# EAGLE schematic Projet_4A (EAGLE 9.6.2)
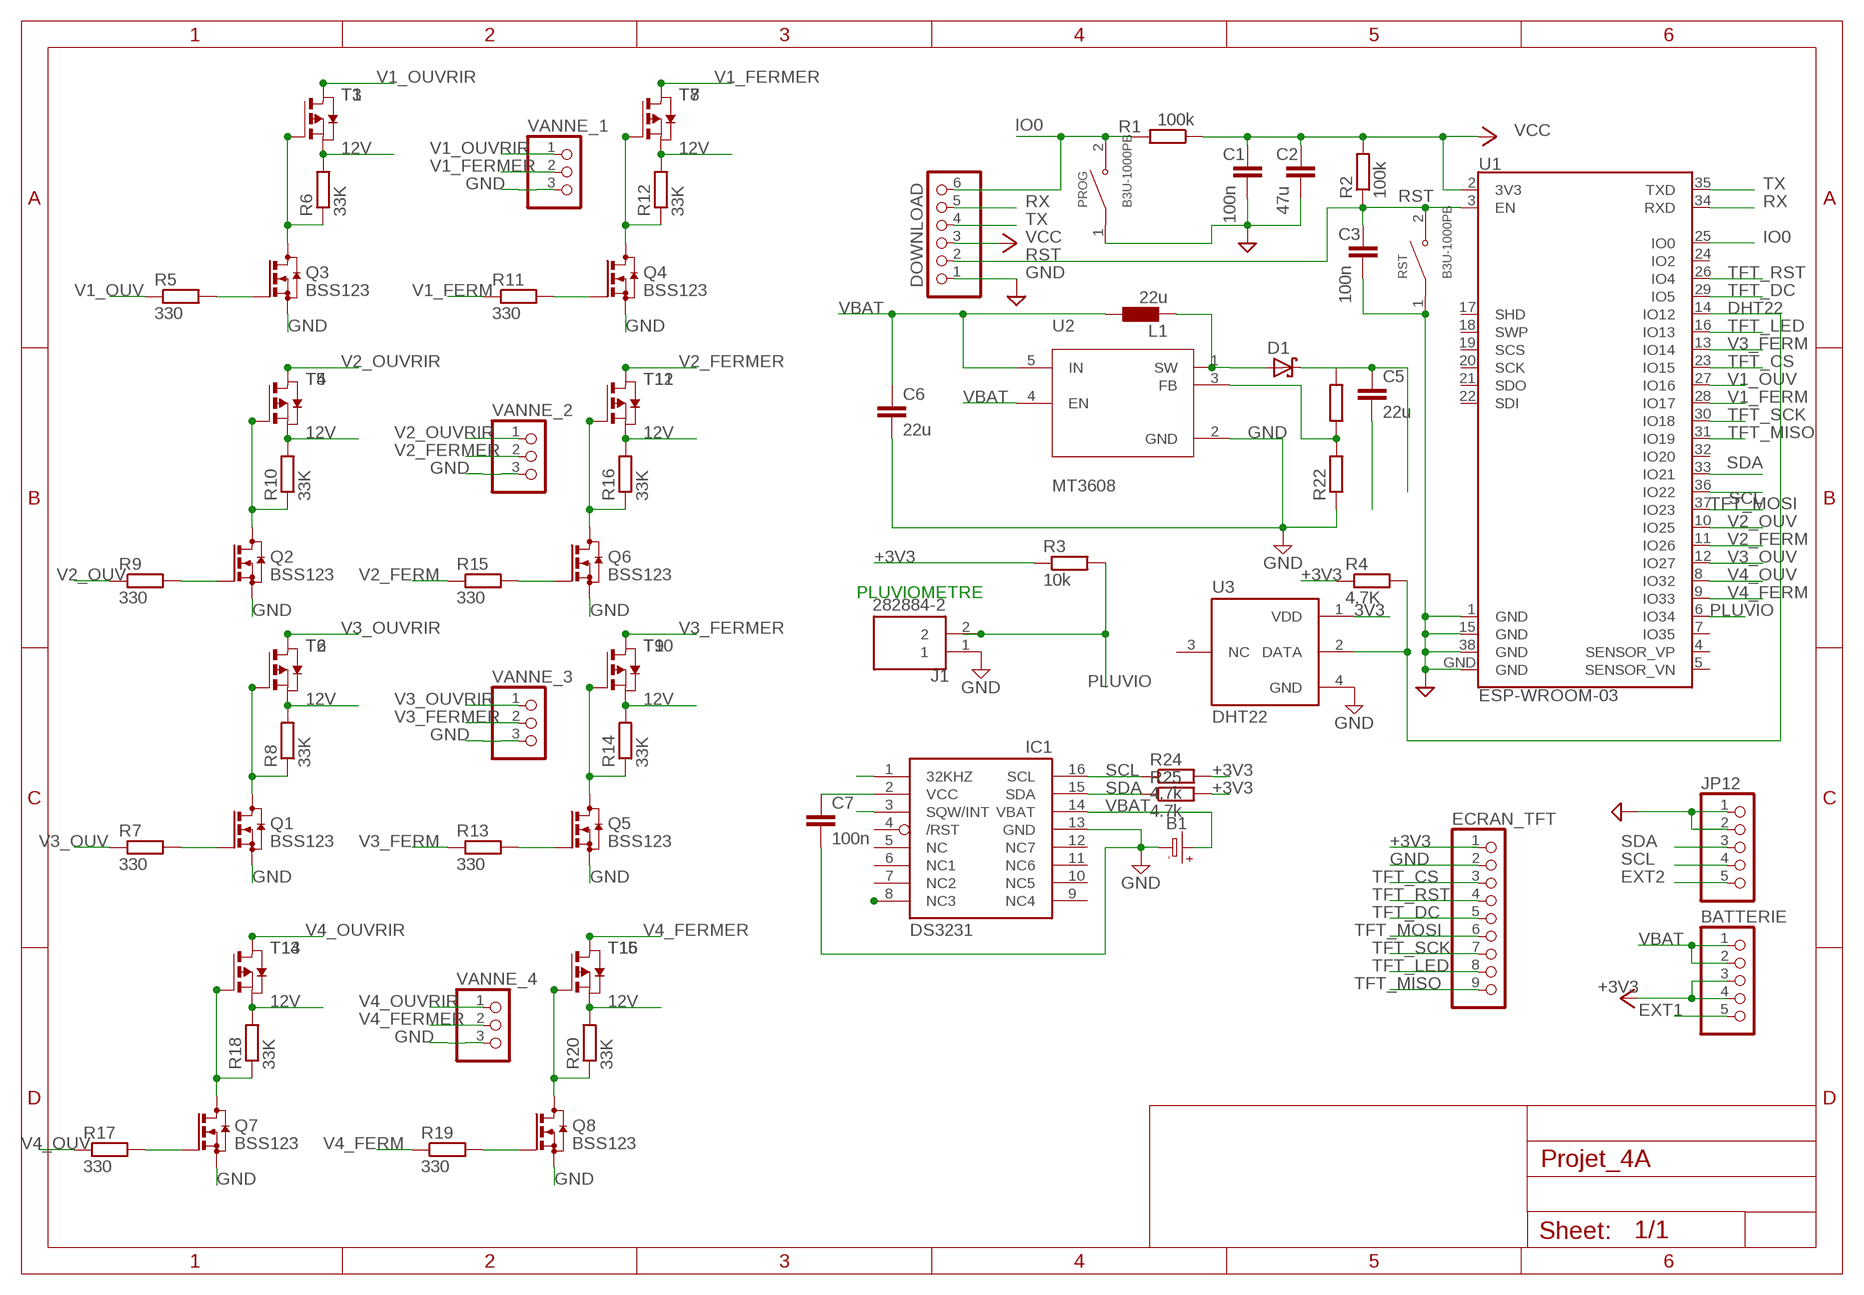
[diagram p0: schematic, sheet 1]

## Parts
B1  BATTERYCR2032_BAT-HLD-001  [CR2032_SMT_BAT-HLD-001]
BATTERIE  PINHD-1X5S  [1X05S]
C1  100n  C  [C0805]
C2  47u  C  [C0805]
C3  100n  C  [C0805]
C5  22u  C  [C0805]
C6  22u  C  [C0805]
C7  100n  C  [C0805]
D1  SCHOTTKY-DIODEAG  [AG]
DOWNLOAD  PINHD-1X6S  [1X06S]
ECRAN_TFT  PINHD-1X9  [1X09]
IC1  DS3231/SO  [SO16W]
J1  282884-2  [TE_282884-2]
JP12  PINHD-1X5S  [1X05S]
L1  22u  L0204/7  [0204/7]
PROG  B3U-1000PB  [SW_B3U-1000PB]
Q1  BSS123  [SOT23]
Q2  BSS123  [SOT23]
Q3  BSS123  [SOT23]
Q4  BSS123  [SOT23]
Q5  BSS123  [SOT23]
Q6  BSS123  [SOT23]
Q7  BSS123  [SOT23]
Q8  BSS123  [SOT23]
R1  100k  RR1206  [R1206]
R2  100k  RR1206  [R1206]
R3  10k  R-EU_R0805  [R0805]
R4  4,7K  R-EU_0207/10  [0207/10]
R5  330  R-EU_0207/10  [0207/10]
R6  33K  R-EU_0207/10  [0207/10]
R7  330  R-EU_0207/10  [0207/10]
R8  33K  R-EU_0207/10  [0207/10]
R9  330  R-EU_0207/10  [0207/10]
R10  33K  R-EU_0207/10  [0207/10]
R11  330  R-EU_0207/10  [0207/10]
R12  33K  R-EU_0207/10  [0207/10]
R13  330  R-EU_0207/10  [0207/10]
R14  33K  R-EU_0207/10  [0207/10]
R15  330  R-EU_0207/10  [0207/10]
R16  33K  R-EU_0207/10  [0207/10]
R17  330  R-EU_0207/10  [0207/10]
R18  33K  R-EU_0207/10  [0207/10]
R19  330  R-EU_0207/10  [0207/10]
R20  33K  R-EU_0207/10  [0207/10]
R22  R-EU_0204/2V  [0204V]
R24  4,7k  R-EU_0204/2V  [0204V]
R25  4.7k  R-EU_0204/2V  [0204V]
RST  B3U-1000PB  [SW_B3U-1000PB]
T1  PMOSSOT23  [SOT-23]
T2  PMOSSOT23  [SOT-23]
T3  PMOSSOT23  [SOT-23]
T4  PMOSSOT23  [SOT-23]
T5  PMOSSOT23  [SOT-23]
T6  PMOSSOT23  [SOT-23]
T7  PMOSSOT23  [SOT-23]
T8  PMOSSOT23  [SOT-23]
T9  PMOSSOT23  [SOT-23]
T10  PMOSSOT23  [SOT-23]
T11  PMOSSOT23  [SOT-23]
T12  PMOSSOT23  [SOT-23]
T13  PMOSSOT23  [SOT-23]
T14  PMOSSOT23  [SOT-23]
T15  PMOSSOT23  [SOT-23]
T16  PMOSSOT23  [SOT-23]
U1  ESP-WROOM-03  [ESP-WROOM-03]
U2  MT3608  [SOT95P280X145-6N]
U3  DHT22  [XDCR_DHT22]
VANNE_1  PINHD-1X3  [1X03]
VANNE_2  PINHD-1X3  [1X03]
VANNE_3  PINHD-1X3  [1X03]
VANNE_4  PINHD-1X3  [1X03]

## Nets
3V3: U3.1(VDD)
12V: C5.1 D1.C R6.2 R8.2 R10.2 R12.2 R14.2 R16.2 R18.2 R20.2 T1.2(S) T2.2(S) T3.2(S) T4.2(S) T5.2(S) T6.2(S) T7.2(S) T8.2(S) T9.2(S) T10.2(S) T11.2(S) T12.2(S) T13.2(S) T14.2(S) T15.2(S) T16.2(S)
+3V3: BATTERIE.3 BATTERIE.4 C7.1 ECRAN_TFT.1 IC1.2(VCC) R3.1 R4.1 R24.2 R25.2
+12V: Q3.3(D) R6.1 T1.3(G) T3.3(G)
+12V1: Q2.3(D) R10.1 T4.3(G) T5.3(G)
+12V2: Q1.3(D) R8.1 T2.3(G) T6.3(G)
+12V3: Q4.3(D) R12.1 T7.3(G) T8.3(G)
+12V4: Q5.3(D) R14.1 T9.3(G) T10.3(G)
+12V5: Q6.3(D) R16.1 T11.3(G) T12.3(G)
+12V6: Q7.3(D) R18.1 T13.3(G) T14.3(G)
+12V7: Q8.3(D) R20.1 T15.3(G) T16.3(G)
DHT22: R4.2 U1.14(IO12) U3.2(DATA)
EXT1: BATTERIE.5
EXT2: JP12.5
GND: B1.- C1.2 C2.2 C3.2 C6.2 C7.2 DOWNLOAD.1 ECRAN_TFT.2 IC1.13(GND) J1.1 JP12.1 JP12.2 PROG.1 Q1.2(S) Q2.2(S) Q3.2(S) Q4.2(S) Q5.2(S) Q6.2(S) Q7.2(S) Q8.2(S) R22.1 RST.1 U1.1(GND) U1.15(GND) U1.38(GND) U1.GND U2.2(GND) U3.4(GND) VANNE_1.3 VANNE_2.3 VANNE_3.3 VANNE_4.3
GND1: C5.2
IO0: DOWNLOAD.6 PROG.2 R1.2 U1.25(IO0)
N$1: Q3.1(G) R5.2
N$2: IC1.8(NC3)
N$3: Q2.1(G) R9.2
N$6: Q1.1(G) R7.2
N$7: Q4.1(G) R11.2
N$8: Q5.1(G) R13.2
N$9: Q6.1(G) R15.2
N$10: Q7.1(G) R17.2
N$11: Q8.1(G) R19.2
N$12: D1.A L1.2 U2.1(SW)
N$14: R22.2 U2.3(FB)
N$16: IC1.3(SQW/INT)
N$18: IC1.1(32KHZ)
PLUVIO: J1.2 R3.2 U1.6(IO34)
RST: C3.1 DOWNLOAD.2 R2.1 RST.2 U1.3(EN)
RX: DOWNLOAD.5 U1.34(RXD)
SCL: IC1.16(SCL) JP12.4 R24.1 U1.36(IO22)
SDA: IC1.15(SDA) JP12.3 R25.1 U1.33(IO21)
TFT_CS: ECRAN_TFT.3 U1.23(IO15)
TFT_DC: ECRAN_TFT.5 U1.29(IO5)
TFT_LED: ECRAN_TFT.8 U1.16(IO13)
TFT_MISO: ECRAN_TFT.9 U1.31(IO19)
TFT_MOSI: ECRAN_TFT.6 U1.37(IO23)
TFT_RST: ECRAN_TFT.4 U1.26(IO4)
TFT_SCK: ECRAN_TFT.7 U1.30(IO18)
TX: DOWNLOAD.4 U1.35(TXD)
V1_FERM: R11.1 U1.28(IO17)
V1_FERMER: T7.1(D) T8.1(D) VANNE_1.2
V1_OUV: R5.1 U1.27(IO16)
V1_OUVRIR: T1.1(D) T3.1(D) VANNE_1.1
V2_FERM: R15.1 U1.11(IO26)
V2_FERMER: T11.1(D) T12.1(D) VANNE_2.2
V2_OUV: R9.1 U1.10(IO25)
V2_OUVRIR: T4.1(D) T5.1(D) VANNE_2.1
V3_FERM: R13.1 U1.13(IO14)
V3_FERMER: T9.1(D) T10.1(D) VANNE_3.2
V3_OUV: R7.1 U1.12(IO27)
V3_OUVRIR: T2.1(D) T6.1(D) VANNE_3.1
V4_FERM: R19.1 U1.9(IO33)
V4_FERMER: T15.1(D) T16.1(D) VANNE_4.2
V4_OUV: R17.1 U1.8(IO32)
V4_OUVRIR: T13.1(D) T14.1(D) VANNE_4.1
VBAT: B1.+$1(+) B1.+$2(+) BATTERIE.1 BATTERIE.2 C6.1 IC1.14(VBAT) L1.1 U2.4(EN) U2.5(IN)
VCC: C1.1 C2.1 DOWNLOAD.3 R1.1 R2.2 U1.2(3V3)
Unconnected: IC1.4(/RST) IC1.5(NC) IC1.6(NC1) IC1.7(NC2) IC1.9(NC4) IC1.10(NC5) IC1.11(NC6) IC1.12(NC7) U1.4(SENSOR_VP) U1.5(SENSOR_VN) U1.7(IO35) U1.17(SHD) U1.18(SWP) U1.19(SCS) U1.20(SCK) U1.21(SDO) U1.22(SDI) U1.24(IO2) U1.32(IO20) U3.3(NC)

## Notes on the sheet
- PLUVIOMETRE

## Library data of the parts
B1 = Fidget_Spinner:BATTERY: CR1220 SMT - Digikey: 3001K-ND
BATTERIE JP12 = pinheadCP:PINHD-1X5: PIN HEADER
C1-C3 C5-C7 = eagle-ltspice:C: CAPACITOR, European symbol; SPICEMODEL: NONE; SPICEPREFIX: C
D1 = adafruit:SCHOTTKY-DIODE: Schottky Diode
DOWNLOAD = pinheadCP:PINHD-1X6: PIN HEADER
ECRAN_TFT = pinhead:PINHD-1X9: PIN HEADER
IC1 = DS3231:DS3231: Check availability <https://pricing.snapeda.com/parts/DS3231/Analog%20Devices/view-part?ref=eda>; AVAILABILITY: In Stock; CHECK_PRICES: https://www.snapeda.com/parts/DS3231/Analog+Devices/view-part/?ref=eda; DESCRIPTION: Real Time Clock (RTC) IC Clock/Calendar - I²C, 2-Wire Serial 8-SOIC (0.154, 3.90mm Width); MF: Analog Devices; MP: DS3231; PACKAGE: SOIC-16 Maxim Integrated; PRICE: None; PURCHASE-URL: https://www.snapeda.com/api/url_track_click_mouser/?unipart_id=553791&manufacturer=Analog Devices&part_name=DS3231&search_term= ds3231; SNAPEDA_LINK: https://www.snapeda.com/parts/DS3231/Analog+Devices/view-part/?ref=snap
J1 = 282884-2:282884-2: Check availability <https://pricing.snapeda.com/parts/282884-2/TE%20Connectivity/view-part?ref=eda>; AVAILABILITY: In Stock; CHECK_PRICES: https://www.snapeda.com/parts/282884-2/TE+Connectivity+AMP+Connectors/view-part/?ref=eda; COMMENT: 282884-2; DESCRIPTION: 2 Position Wire to Board Terminal Block Horizontal with Board 0.197 (5.00mm) Through Hole; EU_ROHS_COMPLIANCE: Compliant with Exemptions; MF: TE Connectivity; MP: 282884-2; PACKAGE: None; PRICE: None; PURCHASE-URL: https://www.snapeda.com/api/url_track_click_mouser/?unipart_id=2384133&manufacturer=TE Connectivity&part_name=282884-2&search_term=ak500/2; SNAPEDA_LINK: https://www.snapeda.com/parts/282884-2/TE+Connectivity+AMP+Connectors/view-part/?ref=snap
L1 = eagle-ltspice:L: INDUCTOR, European symbol; SPICEMODEL: NONE; SPICEPREFIX: L
PROG RST = SnapEDA-Library2:B3U-1000P: Switch Tactile N.O. SPST Round Button Gull Wing 0.05A 12VDC 1.5N SMD Embossed T/R
Q1-Q8 = transistor-small-signal:BSS123: N-CHANNEL MOS FET
R1 R2 = eagle-ltspice:R: RESISTOR, European symbol; SPICEMODEL: NONE; SPICEPREFIX: R
R3-R20 R22 R24 R25 = resistor:R-EU_: RESISTOR, European symbol
T1-T16 = zetex:PMOSSOT23: MOS FET; OC_FARNELL: unknown; OC_NEWARK: unknown
U1 = esp32-sparkfun (1):ESP-WROOM-03; OC_FARNELL: unknown
U2 = SnapEDA-Library2:MT3608: High Efficiency 1.2MHz 2A Step Up Converter; MANUFACTURER: Aero Semi; MAXIMUM_PACKAGE_HEIGHT: 1.45mm; PARTREV: 1.0; STANDARD: IPC-7351B
U3 = DHT22:DHT22: Check availability <https://pricing.snapeda.com/parts/DHT22/Aosong%20Electronics/view-part?ref=eda>; AVAILABILITY: Not in stock; CHECK_PRICES: https://www.snapeda.com/parts/DHT22/Aosong+Electronics/view-part/?ref=eda; DESCRIPTION: Capacitive-type humidity and temperature module/sensor; MF: Aosong Electronics; MP: DHT22; PACKAGE: Package; PRICE: None; SNAPEDA_LINK: https://www.snapeda.com/parts/DHT22/Aosong+Electronics/view-part/?ref=snap
VANNE_1-VANNE_4 = pinhead:PINHD-1X3: PIN HEADER